# Altium project STM32H7_PCI_CARD.PrjPcb
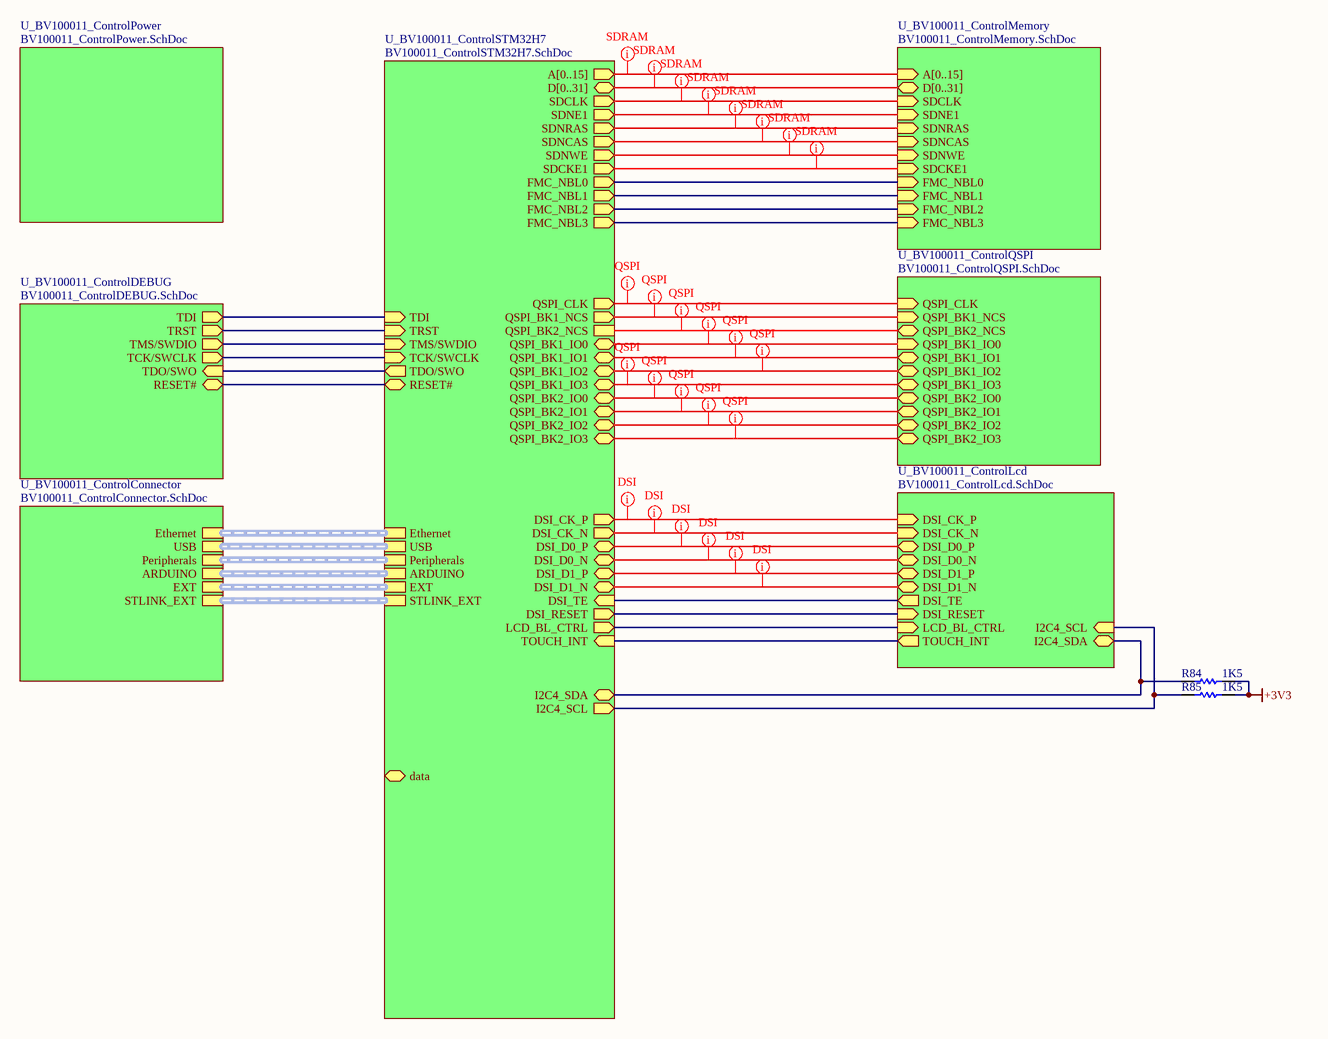
[diagram p0: BV100011_ControlTopLevel.SchDoc]
4 sheets, 175 parts. Net scope: hierarchical (ports join the sheet entries above them; power ports are global).
Board file: STM32H7_PCI_CARD.PcbDoc
Sheets:
  BV100011_ControlTopLevel.SchDoc
    U_BV100011_ControlSTM32H7 = BV100011_ControlSTM32H7.SchDoc
    U_BV100011_ControlPower = BV100011_ControlPower.SchDoc
    U_BV100011_ControlMemory = BV100011_ControlMemory.SchDoc

## Sheet BV100011_ControlTopLevel.SchDoc
size A3

### Parts
R84  1K5  [R0603]
R85  1K5  [R0603]

### Sub-sheets
U_BV100011_ControlConnector = BV100011_ControlConnector.SchDoc (file not in this document): Ethernet (harness Ethernet), USB (harness USB), Peripherals (harness Peripherals), ARDUINO (harness ARDUINO), EXT (harness EXT), STLINK_EXT (harness STLINK_EXT)
U_BV100011_ControlDEBUG = BV100011_ControlDEBUG.SchDoc (file not in this document): TDI (out), RESET# (bidir), TRST (out), TMS/SWDIO (out), TCK/SWCLK (out), TDO/SWO (in)
U_BV100011_ControlLcd = BV100011_ControlLcd.SchDoc (file not in this document): DSI_CK_P (in), DSI_CK_N (in), DSI_D0_P (bidir), DSI_D0_N (bidir), DSI_D1_P (bidir), DSI_D1_N (bidir), LCD_BL_CTRL (in), DSI_TE (out), I2C4_SDA (bidir), I2C4_SCL (in), TOUCH_INT (out), DSI_RESET (in)
U_BV100011_ControlMemory = BV100011_ControlMemory.SchDoc: FMC_NBL0 (in), FMC_NBL1 (in), D[0..31] (bidir), A[0..15] (in), SDNCAS (in), SDNWE (in), SDNRAS (in), SDNE1 (in), SDCKE1 (in), SDCLK (in), FMC_NBL3 (in), FMC_NBL2 (in)
U_BV100011_ControlPower = BV100011_ControlPower.SchDoc: no entries
U_BV100011_ControlQSPI = BV100011_ControlQSPI.SchDoc (file not in this document): QSPI_BK1_IO3 (bidir), QSPI_BK1_IO1 (bidir), QSPI_BK1_NCS (in), QSPI_BK1_IO0 (in), QSPI_BK1_IO2 (bidir), QSPI_CLK (in), QSPI_BK2_IO0 (bidir), QSPI_BK2_IO1 (bidir), QSPI_BK2_IO2 (bidir), QSPI_BK2_IO3 (bidir), QSPI_BK2_NCS (bidir)
U_BV100011_ControlSTM32H7 = BV100011_ControlSTM32H7.SchDoc: TMS/SWDIO (in), TCK/SWCLK (in), TDI (in), TDO/SWO (out), TRST (in), QSPI_CLK (out), QSPI_BK1_IO0 (bidir), FMC_NBL0 (out), FMC_NBL1 (out), SDNRAS (out), QSPI_BK1_IO3 (bidir), QSPI_BK1_IO2 (bidir), QSPI_BK1_IO1 (bidir), SDCLK (out), SDNCAS (out), QSPI_BK1_NCS (out), QSPI_BK2_IO2 (bidir), QSPI_BK2_IO3 (bidir), SDCKE1 (out), SDNE1 (out), SDNWE (out), QSPI_BK2_IO0 (bidir), QSPI_BK2_IO1 (bidir), FMC_NBL3 (out), FMC_NBL2 (out), D[0..31] (bidir), A[0..15] (out), DSI_CK_P (out), DSI_CK_N (out), DSI_D0_P (bidir), DSI_D0_N (bidir), DSI_D1_P (bidir), DSI_D1_N (bidir), LCD_BL_CTRL (out), I2C4_SCL (out), I2C4_SDA (bidir), TOUCH_INT (in), DSI_RESET (out), DSI_TE (in), RESET# (bidir), Ethernet (harness Ethernet), USB (harness USB), Peripherals (harness Peripherals), ARDUINO (harness ARDUINO), EXT (harness EXT), STLINK_EXT (harness STLINK_EXT), QSPI_BK2_NCS, data (bidir)

### Nets
+3V3: R84.1 R85.1
DSI_CK_N: sheet U_BV100011_ControlSTM32H7/DSI_CK_N, sheet U_BV100011_ControlLcd/DSI_CK_N
DSI_CK_P: sheet U_BV100011_ControlSTM32H7/DSI_CK_P, sheet U_BV100011_ControlLcd/DSI_CK_P
DSI_D0_N: sheet U_BV100011_ControlSTM32H7/DSI_D0_N, sheet U_BV100011_ControlLcd/DSI_D0_N
DSI_D0_P: sheet U_BV100011_ControlSTM32H7/DSI_D0_P, sheet U_BV100011_ControlLcd/DSI_D0_P
DSI_D1_N: sheet U_BV100011_ControlSTM32H7/DSI_D1_N, sheet U_BV100011_ControlLcd/DSI_D1_N
DSI_D1_P: sheet U_BV100011_ControlSTM32H7/DSI_D1_P, sheet U_BV100011_ControlLcd/DSI_D1_P
PA13: sheet U_BV100011_ControlSTM32H7/TMS/SWDIO, sheet U_BV100011_ControlDEBUG/TMS/SWDIO
PA14: sheet U_BV100011_ControlSTM32H7/TCK/SWCLK, sheet U_BV100011_ControlDEBUG/TCK/SWCLK
PA15: sheet U_BV100011_ControlSTM32H7/TDI, sheet U_BV100011_ControlDEBUG/TDI
PB2: sheet U_BV100011_ControlSTM32H7/QSPI_CLK, sheet U_BV100011_ControlQSPI/QSPI_CLK
PB3: sheet U_BV100011_ControlSTM32H7/TDO/SWO, sheet U_BV100011_ControlDEBUG/TDO/SWO
PB4: sheet U_BV100011_ControlSTM32H7/TRST, sheet U_BV100011_ControlDEBUG/TRST
PD11: sheet U_BV100011_ControlSTM32H7/QSPI_BK1_IO0, sheet U_BV100011_ControlQSPI/QSPI_BK1_IO0
PD12: R85.2 ; sheet U_BV100011_ControlSTM32H7/I2C4_SCL, sheet U_BV100011_ControlLcd/I2C4_SCL
PD13: R84.2 ; sheet U_BV100011_ControlSTM32H7/I2C4_SDA, sheet U_BV100011_ControlLcd/I2C4_SDA
PE0: sheet U_BV100011_ControlSTM32H7/FMC_NBL0, sheet U_BV100011_ControlMemory/FMC_NBL0
PE1: sheet U_BV100011_ControlSTM32H7/FMC_NBL1, sheet U_BV100011_ControlMemory/FMC_NBL1
PF6: sheet U_BV100011_ControlSTM32H7/QSPI_BK1_IO3, sheet U_BV100011_ControlQSPI/QSPI_BK1_IO3
PF7: sheet U_BV100011_ControlSTM32H7/QSPI_BK1_IO2, sheet U_BV100011_ControlQSPI/QSPI_BK1_IO2
PF9: sheet U_BV100011_ControlSTM32H7/QSPI_BK1_IO1, sheet U_BV100011_ControlQSPI/QSPI_BK1_IO1
PF11: sheet U_BV100011_ControlSTM32H7/SDNRAS, sheet U_BV100011_ControlMemory/SDNRAS
PG3: sheet U_BV100011_ControlSTM32H7/DSI_RESET, sheet U_BV100011_ControlLcd/DSI_RESET
PG6: sheet U_BV100011_ControlSTM32H7/QSPI_BK1_NCS, sheet U_BV100011_ControlQSPI/QSPI_BK1_NCS
PG8: sheet U_BV100011_ControlSTM32H7/SDCLK, sheet U_BV100011_ControlMemory/SDCLK
PG9: sheet U_BV100011_ControlSTM32H7/QSPI_BK2_IO2, sheet U_BV100011_ControlQSPI/QSPI_BK2_IO2
PG14: sheet U_BV100011_ControlSTM32H7/QSPI_BK2_IO3, sheet U_BV100011_ControlQSPI/QSPI_BK2_IO3
PG15: sheet U_BV100011_ControlSTM32H7/SDNCAS, sheet U_BV100011_ControlMemory/SDNCAS
PH2: sheet U_BV100011_ControlSTM32H7/QSPI_BK2_IO0, sheet U_BV100011_ControlQSPI/QSPI_BK2_IO0
PH3: sheet U_BV100011_ControlSTM32H7/QSPI_BK2_IO1, sheet U_BV100011_ControlQSPI/QSPI_BK2_IO1
PH5: sheet U_BV100011_ControlSTM32H7/SDNWE, sheet U_BV100011_ControlMemory/SDNWE
PH6: sheet U_BV100011_ControlSTM32H7/SDNE1, sheet U_BV100011_ControlMemory/SDNE1
PH7: sheet U_BV100011_ControlSTM32H7/SDCKE1, sheet U_BV100011_ControlMemory/SDCKE1
PI4: sheet U_BV100011_ControlSTM32H7/FMC_NBL2, sheet U_BV100011_ControlMemory/FMC_NBL2
PI5: sheet U_BV100011_ControlSTM32H7/FMC_NBL3, sheet U_BV100011_ControlMemory/FMC_NBL3
PJ2: sheet U_BV100011_ControlSTM32H7/DSI_TE, sheet U_BV100011_ControlLcd/DSI_TE
PJ12: sheet U_BV100011_ControlSTM32H7/LCD_BL_CTRL, sheet U_BV100011_ControlLcd/LCD_BL_CTRL
PK7: sheet U_BV100011_ControlSTM32H7/TOUCH_INT, sheet U_BV100011_ControlLcd/TOUCH_INT
RESET#: sheet U_BV100011_ControlSTM32H7/RESET#, sheet U_BV100011_ControlDEBUG/RESET#
NetSB16_1: sheet U_BV100011_ControlSTM32H7/QSPI_BK2_NCS, sheet U_BV100011_ControlQSPI/QSPI_BK2_NCS

### Buses and harness runs
bus sheet U_BV100011_ControlMemory/A[0..15] = sheet U_BV100011_ControlSTM32H7/A[0..15]
bus sheet U_BV100011_ControlMemory/D[0..31] = sheet U_BV100011_ControlSTM32H7/D[0..31]
harness sheet U_BV100011_ControlConnector/ARDUINO = sheet U_BV100011_ControlSTM32H7/ARDUINO
harness sheet U_BV100011_ControlConnector/Ethernet = sheet U_BV100011_ControlSTM32H7/Ethernet
harness sheet U_BV100011_ControlConnector/EXT = sheet U_BV100011_ControlSTM32H7/EXT
harness sheet U_BV100011_ControlConnector/Peripherals = sheet U_BV100011_ControlSTM32H7/Peripherals
harness sheet U_BV100011_ControlConnector/STLINK_EXT = sheet U_BV100011_ControlSTM32H7/STLINK_EXT
harness sheet U_BV100011_ControlConnector/USB = sheet U_BV100011_ControlSTM32H7/USB

### Layout directives
rule Matched Net Lengths [Tolerance = 100mil]; net class SDRAM: (no net found under the mark), PF11, PG8, PG15, PH5, PH6, PH7
rule Matched Net Lengths [Tolerance = 100mil]; net class QSPI: NetSB16_1, PB2, PD11, PF6, PF7, PF9, PG6, PG9, PG14, PH2, PH3
rule Matched Net Lengths [Tolerance = 100mil]; net class DSI: DSI_CK_N, DSI_CK_P, DSI_D0_N, DSI_D0_P, DSI_D1_N, DSI_D1_P

### Library data of the parts
R84 R85 = Res1: Resistor; Value: 1K; Published: 8-Jun-2000; Revision: July-2002: Re-released for DXP Platform.; Publisher: Altium Limited

## Sheet BV100011_ControlSTM32H7.SchDoc
size A3
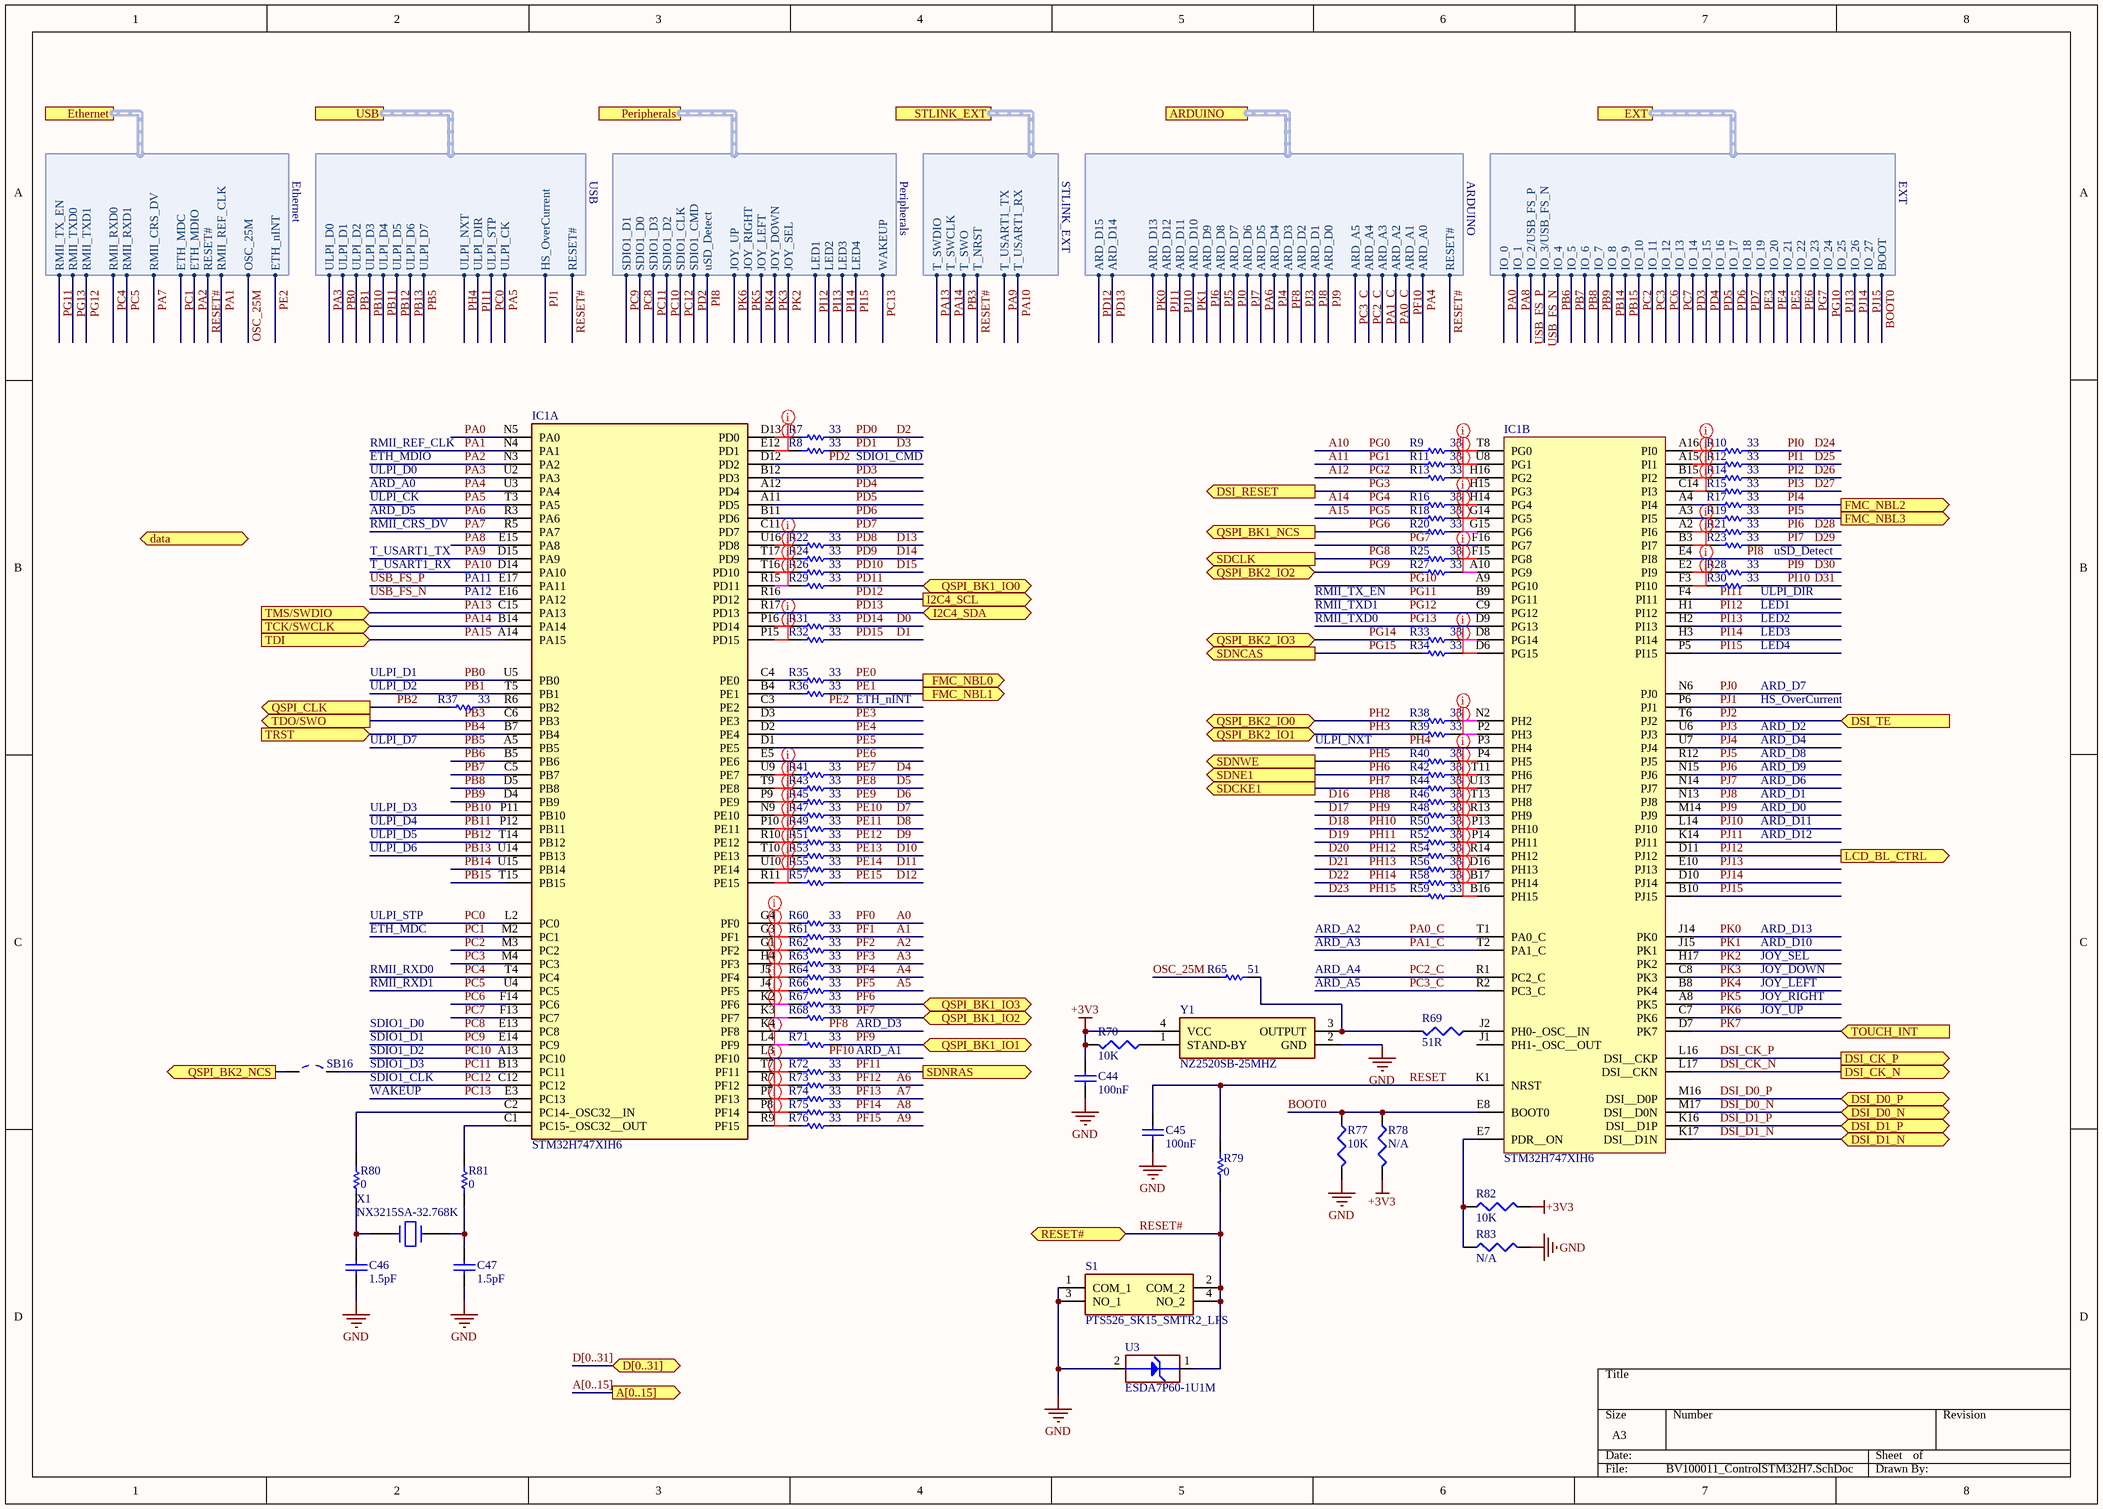
[diagram p1: BV100011_ControlSTM32H7.SchDoc]

### Parts
C44  100nF  [C0402]
C45  100nF  [C0402]
C46  value 1.5pF  [C0402]  (hidden comment: Capacitor)
C47  value 1.5pF  [C0402]  (hidden comment: Capacitor)
IC1  STM32H747XIH6  [BGA265C80P17X17_1400X1400X110]  (parts A,B of 3)
R7  33  [R0402]
R8  33  [R0402]
R9  33  [R0402]
R10  33  [R0402]
R11  33  [R0402]
R12  33  [R0402]
R13  33  [R0402]
R14  33  [R0402]
R15  33  [R0402]
R16  33  [R0402]
R17  33  [R0402]
R18  33  [R0402]
R19  33  [R0402]
R20  33  [R0402]
R21  33  [R0402]
R22  33  [R0402]
R23  33  [R0402]
R24  33  [R0402]
R25  33  [R0402]
R26  33  [R0402]
R27  33  [R0402]
R28  33  [R0402]
R29  33  [R0402]
R30  33  [R0402]
R31  33  [R0402]
R32  33  [R0402]
R33  33  [R0402]
R34  33  [R0402]
R35  33  [R0402]
R36  33  [R0402]
R37  33  [R0402]
R38  33  [R0402]
R39  33  [R0402]
R40  33  [R0402]
R41  33  [R0402]
R42  33  [R0402]
R43  33  [R0402]
R44  33  [R0402]
R45  33  [R0402]
R46  33  [R0402]
R47  33  [R0402]
R48  33  [R0402]
R49  33  [R0402]
R50  33  [R0402]
R51  33  [R0402]
R52  33  [R0402]
R53  33  [R0402]
R54  33  [R0402]
R55  33  [R0402]
R56  33  [R0402]
R57  33  [R0402]
R58  33  [R0402]
R59  33  [R0402]
R60  33  [R0402]
R61  33  [R0402]
R62  33  [R0402]
R63  33  [R0402]
R64  33  [R0402]
R65  51  [R0402]
R66  33  [R0402]
R67  33  [R0402]
R68  33  [R0402]
R69  51R  [R0402]
R70  10K  [R0402]
R71  33  [R0402]
R72  33  [R0402]
R73  33  [R0402]
R74  33  [R0402]
R75  33  [R0402]
R76  33  [R0402]
R77  10K  [R0603]
R78  N/A  [R0603]
R79  0  [R0603]
R80  0  [R0603]
R81  0  [R0603]
R82  10K  [R0603]
R83  N/A  [R0603]
S1  PTS526_SK15_SMTR2_LFS  [PTS526SK15SMTR2LFS]
SB16  Solder Bridge OFF  [SB_0603]  (value not drawn)
U3  value ESDA7P60-1U1M  [ESD_QFN2_1P6X1_P125]  (hidden comment: ESD-TRANSIL)
X1  value NX3215SA-32.768K  [CRY_NX3215SA_2P]  (hidden comment: XTAL_32K_NX3215SA)
Y1  NZ2520SB-25MHZ  [OSC_NDK_NZ2520SB_4P]

### Ports
A[0..15] (out), ARDUINO (harness ARDUINO), D[0..31] (bidir), data (bidir), DSI_CK_N (out), DSI_CK_P (out), DSI_D0_N (bidir), DSI_D0_P (bidir), DSI_D1_N (bidir), DSI_D1_P (bidir), DSI_RESET (out), DSI_TE (in), Ethernet (harness Ethernet), EXT (harness EXT), FMC_NBL0 (out), FMC_NBL1 (out), FMC_NBL2 (out), FMC_NBL3 (out), I2C4_SCL (out), I2C4_SDA (bidir), LCD_BL_CTRL (out), Peripherals (harness Peripherals), QSPI_BK1_IO0 (bidir), QSPI_BK1_IO1 (bidir), QSPI_BK1_IO2 (bidir), QSPI_BK1_IO3 (bidir), QSPI_BK1_NCS (out), QSPI_BK2_IO0 (bidir), QSPI_BK2_IO1 (bidir), QSPI_BK2_IO2 (bidir), QSPI_BK2_IO3 (bidir), QSPI_BK2_NCS (out), QSPI_CLK (out), RESET# (bidir), SDCKE1 (out), SDCLK (out), SDNCAS (out), SDNE1 (out), SDNRAS (out), SDNWE (out), STLINK_EXT (harness STLINK_EXT), TCK/SWCLK (in), TDI (in), TDO/SWO (out), TMS/SWDIO (in), TOUCH_INT (in), TRST (in), USB (harness USB)

### Harnesses
Ethernet: ETH_nINT, ETH_MDC, RMII_REF_CLK, RMII_TXD1, ETH_MDIO, RMII_CRS_DV, RMII_RXD0, RMII_RXD1, RMII_TX_EN, RMII_TXD0, OSC_25M, RESET#
USB: ULPI_D0, ULPI_D1, ULPI_D2, ULPI_D3, ULPI_D4, ULPI_D5, ULPI_D6, ULPI_D7, ULPI_NXT, ULPI_DIR, ULPI_STP, ULPI_CK, RESET#, HS_OverCurrent
Peripherals: SDIO1_D1, SDIO1_D0, SDIO1_D3, SDIO1_D2, SDIO1_CLK, SDIO1_CMD, uSD_Detect, JOY_UP, JOY_RIGHT, JOY_LEFT, JOY_DOWN, JOY_SEL, LED1, LED2, LED3, LED4, WAKEUP
STLINK_EXT: T_SWDIO, T_SWCLK, T_SWO, T_NRST, T_USART1_TX, T_USART1_RX
ARDUINO: RESET#, ARD_A0, ARD_A1, ARD_A2, ARD_A3, ARD_A4, ARD_A5, ARD_D4, ARD_D3, ARD_D2, ARD_D1, ARD_D0, ARD_D9, ARD_D8, ARD_D7, ARD_D6, ARD_D5, ARD_D14, ARD_D13, ARD_D12, ARD_D11, ARD_D10, ARD_D15
EXT: IO_0, IO_1, IO_3/USB_FS_N, IO_4, IO_5, IO_6, IO_7, IO_8, IO_9, IO_10, IO_11, IO_12, IO_13, IO_14, IO_15, IO_16, IO_17, IO_18, IO_19, IO_20, IO_21, IO_22, IO_23, IO_24, IO_25, IO_26, IO_27, BOOT, IO_2/USB_FS_P

### Nets
+3V3: C44.2 R70.2 R78.2 R82.2 Y1.4(VCC)
GND: C44.1 C45.1 C46.1 C47.1 R77.2 R83.2 S1.1(COM_1) S1.3(NO_1) U3.2(GND) Y1.2(GND)
A0: R60.1  [also labelled PF0]
A1: R61.1  [also labelled PF1]
A2: R62.1  [also labelled PF2]
A3: R63.1  [also labelled PF3]
A4: R64.1  [also labelled PF4]
A5: R66.1  [also labelled PF5]
A6: R73.1  [also labelled PF12]
A7: R74.1  [also labelled PF13]
A8: R75.1  [also labelled PF14]
A9: R76.1  [also labelled PF15]
A10: R9.2  [also labelled PG0]
A11: R11.2  [also labelled PG1]
A12: R13.2  [also labelled PG2]
A14: R16.2  [also labelled PG4]
A15: R18.2  [also labelled PG5]
BOOT0: IC1.E8(BOOT0) R77.1 R78.1 ; port EXT.BOOT
D0: R31.1  [also labelled PD14]
D1: R32.1  [also labelled PD15]
D2: R7.1  [also labelled PD0]
D3: R8.1  [also labelled PD1]
D4: R41.1  [also labelled PE7]
D5: R43.1  [also labelled PE8]
D6: R45.1  [also labelled PE9]
D7: R47.1  [also labelled PE10]
D8: R49.1  [also labelled PE11]
D9: R51.1  [also labelled PE12]
D10: R53.1  [also labelled PE13]
D11: R55.1  [also labelled PE14]
D12: R57.1  [also labelled PE15]
D13: R22.1  [also labelled PD8]
D14: R24.1  [also labelled PD9]
D15: R26.1  [also labelled PD10]
D16: R46.2  [also labelled PH8]
D17: R48.2  [also labelled PH9]
D18: R50.2  [also labelled PH10]
D19: R52.2  [also labelled PH11]
D20: R54.2  [also labelled PH12]
D21: R56.2  [also labelled PH13]
D22: R58.2  [also labelled PH14]
D23: R59.2  [also labelled PH15]
D24: R10.1  [also labelled PI0]
D25: R12.1  [also labelled PI1]
D26: R14.1  [also labelled PI2]
D27: R15.1  [also labelled PI3]
D28: R21.1  [also labelled PI6]
D29: R23.1  [also labelled PI7]
D30: R28.1  [also labelled PI9]
D31: R30.1  [also labelled PI10]
DSI_CK_N: IC1.L17(DSI__CKN) ; port DSI_CK_N
DSI_CK_P: IC1.L16(DSI__CKP) ; port DSI_CK_P
DSI_D0_N: IC1.M17(DSI__D0N) ; port DSI_D0_N
DSI_D0_P: IC1.M16(DSI__D0P) ; port DSI_D0_P
DSI_D1_N: IC1.K17(DSI__D1N) ; port DSI_D1_N
DSI_D1_P: IC1.K16(DSI__D1P) ; port DSI_D1_P
OSC_25M: R65.2 ; port Ethernet.OSC_25M
PA0: IC1.N5(PA0) ; port EXT.IO_0
PA0_C: IC1.T1(PA0_C) ; port ARDUINO.ARD_A2
PA1: IC1.N4(PA1) ; port Ethernet.RMII_REF_CLK
PA1_C: IC1.T2(PA1_C) ; port ARDUINO.ARD_A3
PA2: IC1.N3(PA2) ; port Ethernet.ETH_MDIO
PA3: IC1.U2(PA3) ; port USB.ULPI_D0
PA4: IC1.U3(PA4) ; port ARDUINO.ARD_A0
PA5: IC1.T3(PA5) ; port USB.ULPI_CK
PA6: IC1.R3(PA6) ; port ARDUINO.ARD_D5
PA7: IC1.R5(PA7) ; port Ethernet.RMII_CRS_DV
PA8: IC1.E15(PA8) ; port EXT.IO_1
PA9: IC1.D15(PA9) ; port STLINK_EXT.T_USART1_TX
PA10: IC1.D14(PA10) ; port STLINK_EXT.T_USART1_RX
PA13: IC1.C15(PA13) ; port TMS/SWDIO, port STLINK_EXT.T_SWDIO
PA14: IC1.B14(PA14) ; port TCK/SWCLK, port STLINK_EXT.T_SWCLK
PA15: IC1.A14(PA15) ; port TDI
PB0: IC1.U5(PB0) ; port USB.ULPI_D1
PB1: IC1.T5(PB1) ; port USB.ULPI_D2
PB2: R37.2 ; port QSPI_CLK
PB3: IC1.C6(PB3) ; port TDO/SWO, port STLINK_EXT.T_SWO
PB4: IC1.B7(PB4) ; port TRST
PB5: IC1.A5(PB5) ; port USB.ULPI_D7
PB6: IC1.B5(PB6) ; port EXT.IO_4
PB7: IC1.C5(PB7) ; port EXT.IO_5
PB8: IC1.D5(PB8) ; port EXT.IO_6
PB9: IC1.D4(PB9) ; port EXT.IO_7
PB10: IC1.P11(PB10) ; port USB.ULPI_D3
PB11: IC1.P12(PB11) ; port USB.ULPI_D4
PB12: IC1.T14(PB12) ; port USB.ULPI_D5
PB13: IC1.U14(PB13) ; port USB.ULPI_D6
PB14: IC1.U15(PB14) ; port EXT.IO_8
PB15: IC1.T15(PB15) ; port EXT.IO_9
PC0: IC1.L2(PC0) ; port USB.ULPI_STP
PC1: IC1.M2(PC1) ; port Ethernet.ETH_MDC
PC2: IC1.M3(PC2) ; port EXT.IO_10
PC2_C: IC1.R1(PC2_C) ; port ARDUINO.ARD_A4
PC3: IC1.M4(PC3) ; port EXT.IO_11
PC3_C: IC1.R2(PC3_C) ; port ARDUINO.ARD_A5
PC4: IC1.T4(PC4) ; port Ethernet.RMII_RXD0
PC5: IC1.U4(PC5) ; port Ethernet.RMII_RXD1
PC6: IC1.F14(PC6) ; port EXT.IO_12
PC7: IC1.F13(PC7) ; port EXT.IO_13
PC8: IC1.E13(PC8) ; port Peripherals.SDIO1_D0
PC9: IC1.E14(PC9) ; port Peripherals.SDIO1_D1
PC10: IC1.A13(PC10) ; port Peripherals.SDIO1_D2
PC11: IC1.B13(PC11) SB16.2 ; port Peripherals.SDIO1_D3
PC12: IC1.C12(PC12) ; port Peripherals.SDIO1_CLK
PC13: IC1.E3(PC13) ; port Peripherals.WAKEUP
PD2: IC1.D12(PD2) ; port Peripherals.SDIO1_CMD
PD3: IC1.B12(PD3) ; port EXT.IO_14
PD4: IC1.A12(PD4) ; port EXT.IO_15
PD5: IC1.A11(PD5) ; port EXT.IO_16
PD6: IC1.B11(PD6) ; port EXT.IO_17
PD7: IC1.C11(PD7) ; port EXT.IO_18
PD11: R29.1 ; port QSPI_BK1_IO0
PD12: IC1.R16(PD12) ; port I2C4_SCL, port ARDUINO.ARD_D15
PD13: IC1.R17(PD13) ; port I2C4_SDA, port ARDUINO.ARD_D14
PE0: R35.1 ; port FMC_NBL0
PE1: R36.1 ; port FMC_NBL1
PE2: IC1.C3(PE2) ; port Ethernet.ETH_nINT
PE3: IC1.D3(PE3) ; port EXT.IO_19
PE4: IC1.D2(PE4) ; port EXT.IO_20
PE5: IC1.D1(PE5) ; port EXT.IO_21
PE6: IC1.E5(PE6) ; port EXT.IO_22
PF6: R67.1 ; port QSPI_BK1_IO3
PF7: R68.1 ; port QSPI_BK1_IO2
PF8: IC1.K4(PF8) ; port ARDUINO.ARD_D3
PF9: R71.1 ; port QSPI_BK1_IO1
PF10: IC1.L3(PF10) ; port ARDUINO.ARD_A1
PF11: R72.1 ; port SDNRAS
PG3: IC1.H15(PG3) ; port DSI_RESET
PG6: R20.2 ; port QSPI_BK1_NCS
PG7: IC1.F16(PG7) ; port EXT.IO_23
PG8: R25.2 ; port SDCLK
PG9: R27.2 ; port QSPI_BK2_IO2
PG10: IC1.A9(PG10) ; port EXT.IO_24
PG11: IC1.B9(PG11) ; port Ethernet.RMII_TX_EN
PG12: IC1.C9(PG12) ; port Ethernet.RMII_TXD1
PG13: IC1.D9(PG13) ; port Ethernet.RMII_TXD0
PG14: R33.2 ; port QSPI_BK2_IO3
PG15: R34.2 ; port SDNCAS
PH2: R38.2 ; port QSPI_BK2_IO0
PH3: R39.2 ; port QSPI_BK2_IO1
PH4: IC1.P3(PH4) ; port USB.ULPI_NXT
PH5: R40.2 ; port SDNWE
PH6: R42.2 ; port SDNE1
PH7: R44.2 ; port SDCKE1
PI4: R17.1 ; port FMC_NBL2
PI5: R19.1 ; port FMC_NBL3
PI8: IC1.E4(PI8) ; port Peripherals.uSD_Detect
PI11: IC1.F4(PI11) ; port USB.ULPI_DIR
PI12: IC1.H1(PI12) ; port Peripherals.LED1
PI13: IC1.H2(PI13) ; port Peripherals.LED2
PI14: IC1.H3(PI14) ; port Peripherals.LED3
PI15: IC1.P5(PI15) ; port Peripherals.LED4
PJ0: IC1.N6(PJ0) ; port ARDUINO.ARD_D7
PJ1: IC1.P6(PJ1) ; port USB.HS_OverCurrent
PJ2: IC1.T6(PJ2) ; port DSI_TE
PJ3: IC1.U6(PJ3) ; port ARDUINO.ARD_D2
PJ4: IC1.U7(PJ4) ; port ARDUINO.ARD_D4
PJ5: IC1.R12(PJ5) ; port ARDUINO.ARD_D8
PJ6: IC1.N15(PJ6) ; port ARDUINO.ARD_D9
PJ7: IC1.N14(PJ7) ; port ARDUINO.ARD_D6
PJ8: IC1.N13(PJ8) ; port ARDUINO.ARD_D1
PJ9: IC1.M14(PJ9) ; port ARDUINO.ARD_D0
PJ10: IC1.L14(PJ10) ; port ARDUINO.ARD_D11
PJ11: IC1.K14(PJ11) ; port ARDUINO.ARD_D12
PJ12: IC1.D11(PJ12) ; port LCD_BL_CTRL
PJ13: IC1.E10(PJ13) ; port EXT.IO_25
PJ14: IC1.D10(PJ14) ; port EXT.IO_26
PJ15: IC1.B10(PJ15) ; port EXT.IO_27
PK0: IC1.J14(PK0) ; port ARDUINO.ARD_D13
PK1: IC1.J15(PK1) ; port ARDUINO.ARD_D10
PK2: IC1.H17(PK2) ; port Peripherals.JOY_SEL
PK3: IC1.C8(PK3) ; port Peripherals.JOY_DOWN
PK4: IC1.B8(PK4) ; port Peripherals.JOY_LEFT
PK5: IC1.A8(PK5) ; port Peripherals.JOY_RIGHT
PK6: IC1.C7(PK6) ; port Peripherals.JOY_UP
PK7: IC1.D7(PK7) ; port TOUCH_INT
RESET: C45.2 IC1.K1(NRST) R79.1
RESET#: R79.2 S1.2(COM_2) S1.4(NO_2) U3.1(IO1) ; port RESET#, port Ethernet.RESET#, port USB.RESET#, port STLINK_EXT.T_NRST, port ARDUINO.RESET#
USB_FS_N: IC1.E16(PA12) ; port EXT.IO_3/USB_FS_N
USB_FS_P: IC1.E17(PA11) ; port EXT.IO_2/USB_FS_P
NetC46_2: C46.2 R80.2 X1.1
NetC47_2: C47.2 R81.2 X1.2
NetIC1_A2: IC1.A2(PI6) R21.2
NetIC1_A3: IC1.A3(PI5) R19.2
NetIC1_A4: IC1.A4(PI4) R17.2
NetIC1_A10: IC1.A10(PG9) R27.1
NetIC1_A15: IC1.A15(PI1) R12.2
NetIC1_A16: IC1.A16(PI0) R10.2
NetIC1_B3: IC1.B3(PI7) R23.2
NetIC1_B4: IC1.B4(PE1) R36.2
NetIC1_B15: IC1.B15(PI2) R14.2
NetIC1_B16: IC1.B16(PH15) R59.1
NetIC1_B17: IC1.B17(PH14) R58.1
NetIC1_C1: IC1.C1(PC15-_OSC32__OUT) R81.1
NetIC1_C2: IC1.C2(PC14-_OSC32__IN) R80.1
NetIC1_C4: IC1.C4(PE0) R35.2
NetIC1_C14: IC1.C14(PI3) R15.2
NetIC1_D6: IC1.D6(PG15) R34.1
NetIC1_D8: IC1.D8(PG14) R33.1
NetIC1_D13: IC1.D13(PD0) R7.2
NetIC1_D16: IC1.D16(PH13) R56.1
NetIC1_E2: IC1.E2(PI9) R28.2
NetIC1_E7: IC1.E7(PDR__ON) R82.1 R83.1
NetIC1_E12: IC1.E12(PD1) R8.2
NetIC1_F3: IC1.F3(PI10) R30.2
NetIC1_F15: IC1.F15(PG8) R25.1
NetIC1_G1: IC1.G1(PF2) R62.2
NetIC1_G3: IC1.G3(PF1) R61.2
NetIC1_G4: IC1.G4(PF0) R60.2
NetIC1_G14: IC1.G14(PG5) R18.1
NetIC1_G15: IC1.G15(PG6) R20.1
NetIC1_H4: IC1.H4(PF3) R63.2
NetIC1_H14: IC1.H14(PG4) R16.1
NetIC1_H16: IC1.H16(PG2) R13.1
NetIC1_J2: IC1.J2(PH0-_OSC__IN) R69.1
NetIC1_J4: IC1.J4(PF5) R66.2
NetIC1_J5: IC1.J5(PF4) R64.2
NetIC1_K2: IC1.K2(PF6) R67.2
NetIC1_K3: IC1.K3(PF7) R68.2
NetIC1_L4: IC1.L4(PF9) R71.2
NetIC1_N2: IC1.N2(PH2) R38.1
NetIC1_N9: IC1.N9(PE10) R47.2
NetIC1_P2: IC1.P2(PH3) R39.1
NetIC1_P4: IC1.P4(PH5) R40.1
NetIC1_P7: IC1.P7(PF13) R74.2
NetIC1_P8: IC1.P8(PF14) R75.2
NetIC1_P9: IC1.P9(PE9) R45.2
NetIC1_P10: IC1.P10(PE11) R49.2
NetIC1_P13: IC1.P13(PH10) R50.1
NetIC1_P14: IC1.P14(PH11) R52.1
NetIC1_P15: IC1.P15(PD15) R32.2
NetIC1_P16: IC1.P16(PD14) R31.2
NetIC1_R6: IC1.R6(PB2) R37.1
NetIC1_R7: IC1.R7(PF12) R73.2
NetIC1_R9: IC1.R9(PF15) R76.2
NetIC1_R10: IC1.R10(PE12) R51.2
NetIC1_R11: IC1.R11(PE15) R57.2
NetIC1_R13: IC1.R13(PH9) R48.1
NetIC1_R14: IC1.R14(PH12) R54.1
NetIC1_R15: IC1.R15(PD11) R29.2
NetIC1_T7: IC1.T7(PF11) R72.2
NetIC1_T8: IC1.T8(PG0) R9.1
NetIC1_T9: IC1.T9(PE8) R43.2
NetIC1_T10: IC1.T10(PE13) R53.2
NetIC1_T11: IC1.T11(PH6) R42.1
NetIC1_T13: IC1.T13(PH8) R46.1
NetIC1_T16: IC1.T16(PD10) R26.2
NetIC1_T17: IC1.T17(PD9) R24.2
NetIC1_U8: IC1.U8(PG1) R11.1
NetIC1_U9: IC1.U9(PE7) R41.2
NetIC1_U10: IC1.U10(PE14) R55.2
NetIC1_U13: IC1.U13(PH7) R44.1
NetIC1_U16: IC1.U16(PD8) R22.2
NetR65_1: R65.1 R69.2 Y1.3(OUTPUT)
NetR70_1: R70.1 Y1.1(STAND-BY)
NetSB16_1: SB16.1 ; port QSPI_BK2_NCS

Not connected (* = marked no-connect by the designer): IC1 J1(PH1-_OSC__OUT)

### Buses and harness runs
bus A[0..15] = port A[0..15]
bus D[0..31] = port D[0..31]

### Layout directives
net class SDRAM_MCU; rule Matched Net Lengths [Tolerance = 100mil]: NetIC1_A2, NetIC1_A15, NetIC1_A16, NetIC1_B3, NetIC1_B15, NetIC1_B16, NetIC1_B17, NetIC1_C14, NetIC1_D6, NetIC1_D13, NetIC1_D16, NetIC1_E2, NetIC1_E12, NetIC1_F3, NetIC1_F15, NetIC1_G1, NetIC1_G3, NetIC1_G4, NetIC1_G14, NetIC1_H4, NetIC1_H14, NetIC1_H16, NetIC1_J4, NetIC1_J5, NetIC1_N9, NetIC1_P4, NetIC1_P7, NetIC1_P8, NetIC1_P9, NetIC1_P10, NetIC1_P13, NetIC1_P14, NetIC1_P15, NetIC1_P16, NetIC1_R7, NetIC1_R9, NetIC1_R10, NetIC1_R11, NetIC1_R13, NetIC1_R14, NetIC1_T7, NetIC1_T8, NetIC1_T9, NetIC1_T10, NetIC1_T11, NetIC1_T13, NetIC1_T16, NetIC1_T17, NetIC1_U8, NetIC1_U9, NetIC1_U10, NetIC1_U13, NetIC1_U16
rule Matched Net Lengths [Tolerance = 100mil]; net class QSPI_MCU: NetIC1_A10, NetIC1_D8, NetIC1_G15, NetIC1_K2, NetIC1_K3, NetIC1_L4, NetIC1_N2, NetIC1_P2, NetIC1_R15

### Notes on the sheet
- RMII_REF_CLK
- ETH_MDIO
- ULPI_D0
- ULPI_CK
- ARD_A0
- ARD_D5
- SDIO1_CMD
- RMII_CRS_DV
- T_USART1_TX
- T_USART1_RX
- (near IC1) PA11
- uSD_Detect
- (near IC1) PA12
- RMII_TX_EN
- RMII_TXD1
- RMII_TXD0
- ULPI_DIR
- LED1
- LED2
- LED3
- LED4
- (near R37) ULPI_D1
- (near R37) ULPI_D2
- ETH_nINT
- HS_OverCurrent
- ARD_D7
- (near R37) ULPI_D7
- ULPI_NXT
- ARD_D2
- ARD_D4
- ARD_D6
- ARD_D8
- ARD_D9
- ULPI_D3
- ULPI_D4
- ULPI_D5
- ULPI_D6
- ARD_D0
- ARD_D1
- ARD_D11
- ARD_D12
- ULPI_STP
- ETH_MDC
- RMII_RXD0
- RMII_RXD1
- ARD_A2
- ARD_A3
- ARD_A4
- (near Y1) ARD_A5
- JOY_SEL
- JOY_DOWN
- JOY_LEFT
- ARD_D10
- ARD_D13
- SDIO1_D0
- (near SB16) SDIO1_D1
- (near SB16) SDIO1_D2
- ARD_A1
- ARD_D3
- JOY_RIGHT
- JOY_UP
- WAKEUP
- (near SB16) SDIO1_D3
- (near SB16) SDIO1_CLK

### Library data of the parts
C44 C45 = Cap Semi: Capacitor (Semiconductor SIM Model); Published: 8-Jun-2000; LatestRevisionDate: 29-May-2009; LatestRevisionNote: IPC-7351 Footprint Added.; PackageReference: C1206; Publisher: Altium Limited; PackageDescription: Chip Capacitor; Value: 100nF
C46 C47 = MCD-00563: Capacitor, MLCC, 1.5pF, 50V, NPO, +-0.25pF, 0402, T=0,5mm; Manufacturer_Part_Number: CC0402CRNPO9BN1R5; Manufacturer: YAGEO; Provided_By: Subcon; Initial_Board_Reference: MB1331; Internal_Part_Number: MCD-00563; Status: Released; Part_Type: Capacitor; Package: C0402; ComponentLink1Description: Yageo_Capacitor_NP0_16V-to-50V.pdf; ComponentLink1URL: http://tunmcdsvn.tun.st.com/Component_Datasheet_Library/Trunk/Capacitors/Yageo_Capacitor_NP0_16V-to-50V; ECCN_US: n/a; ECCN_EU: n/a
IC1 = STM32H747XIH6: Integrated Circuit; Manufacturer_Name: STMicroelectronics; Datasheet Link: https://www.st.com/en/microcontrollers-microprocessors/stm32h747xi.html; Height: 1.1mm; Manufacturer_Part_Number: STM32H747XIH6; Mouser Part Number: 511-STM32H747XIH6; Mouser Price/Stock: https://www.mouser.com/Search/Refine.aspx?Keyword=511-STM32H747XIH6
R7-R68 R71-R76 R80 R81 = Res1: Resistor; Value: 1K; Published: 8-Jun-2000; Revision: July-2002: Re-released for DXP Platform.; Publisher: Altium Limited
R69 R70 R77 R78 R82 R83 = Res3: Resistor; Published: 8-Jun-2000; LatestRevisionDate: 29-May-2009; LatestRevisionNote: IPC-7351 Footprint Added.; PackageReference: J1-0603; Publisher: Altium Limited; PackageDescription: Chip Resistor
  R69: Value: 51R
  R70 R77 R82: Value: 10K
  R78 R83: Value: N/A
R79 = res1: Resistor; Value: 1K; Published: 8-Jun-2000; Revision: July-2002: Re-released for DXP Platform.; Publisher: Altium Limited
S1 = PTS526_SK15_SMTR2_LFS: Switch; Manufacturer_Name: C & K COMPONENTS; Manufacturer_Part_Number: PTS526 SK15 SMTR2 LFS; Datasheet Link: https://www.ckswitches.com/media/2780/pts526.pdf; Height: 1.65mm; Mouser Part Number: 611-PTS526SK15SMR2L; Mouser Price/Stock: https://www.mouser.com/Search/Refine.aspx?Keyword=611-PTS526SK15SMR2L
SB16 = SB_OFF: Fitted: NO; Ordered by: Subcon; Revision: July-2002: Re-released for DXP Platform.; ECCN_US/EU: n/a
U3 = MCD-00251: High power transient voltage suppressor, 7V breakdown; Part_Type: IC; Manufacturer: STMICROELECTRONICS; ECCN_US: EAR99; ECCN_EU: NEC; Provided_By: Subcon; Initial_Board_Reference: MB1311; Internal_Part_Number: MCD-00251; Status: Released; Manufacturer_Part_Number: ESDA7P60-1U1M; ComponentLink1Description: STM_ESD_ESDA7P60-1U1M.pdf; ComponentLink1URL: http://tunmcdsvn.tun.st.com/Component_Datasheet_Library/Trunk/Diodes/STM_ESD_ESDA7P60-1U1M
X1 = MCD-00091: Crystal 32.768kHz, 6pF, -+20PPM, R=50K, SMD; Part_Type: Crystal_Osc; Manufacturer_Part_Number: NX3215SA 32.768KHz EXS00A-MU00525; Manufacturer: NDK; ECCN_US: EAR99; ECCN_EU: NEC; Provided_By: STM; Initial_Board_Reference: mb1274; Internal_Part_Number: MCD-00091; Status: Released; ComponentLink1Description: NDK_Crystal-For-ST_NX3215SA 32.768KHz EXS00A-MU00525 (EXS10B-21238).pdf; ComponentLink1URL: http://tunmcdsvn.tun.st.com/Component_Datasheet_Library/Trunk/Crystal_Osc/NDK_Crystal-For-ST_NX3215SA 32.768KHz EXS00A-MU00525 (EXS10B-21238).pdf
Y1 = NZ2520SB-25.600MHZ: Crystal or Oscillator; Manufacturer_Name: NDK; Datasheet Link: https://media.digikey.com/PDF/Data%20Sheets/NDK%20PDFs/NZ2520SB.pdf; Height: 0.9mm; Manufacturer_Part_Number: NZ2520SB-25.600MHZ; Mouser Part Number: N/A; Mouser Price/Stock: https://www.mouser.com/Search/Refine.aspx?Keyword=N%2FA

## Sheet BV100011_ControlPower.SchDoc
size A4
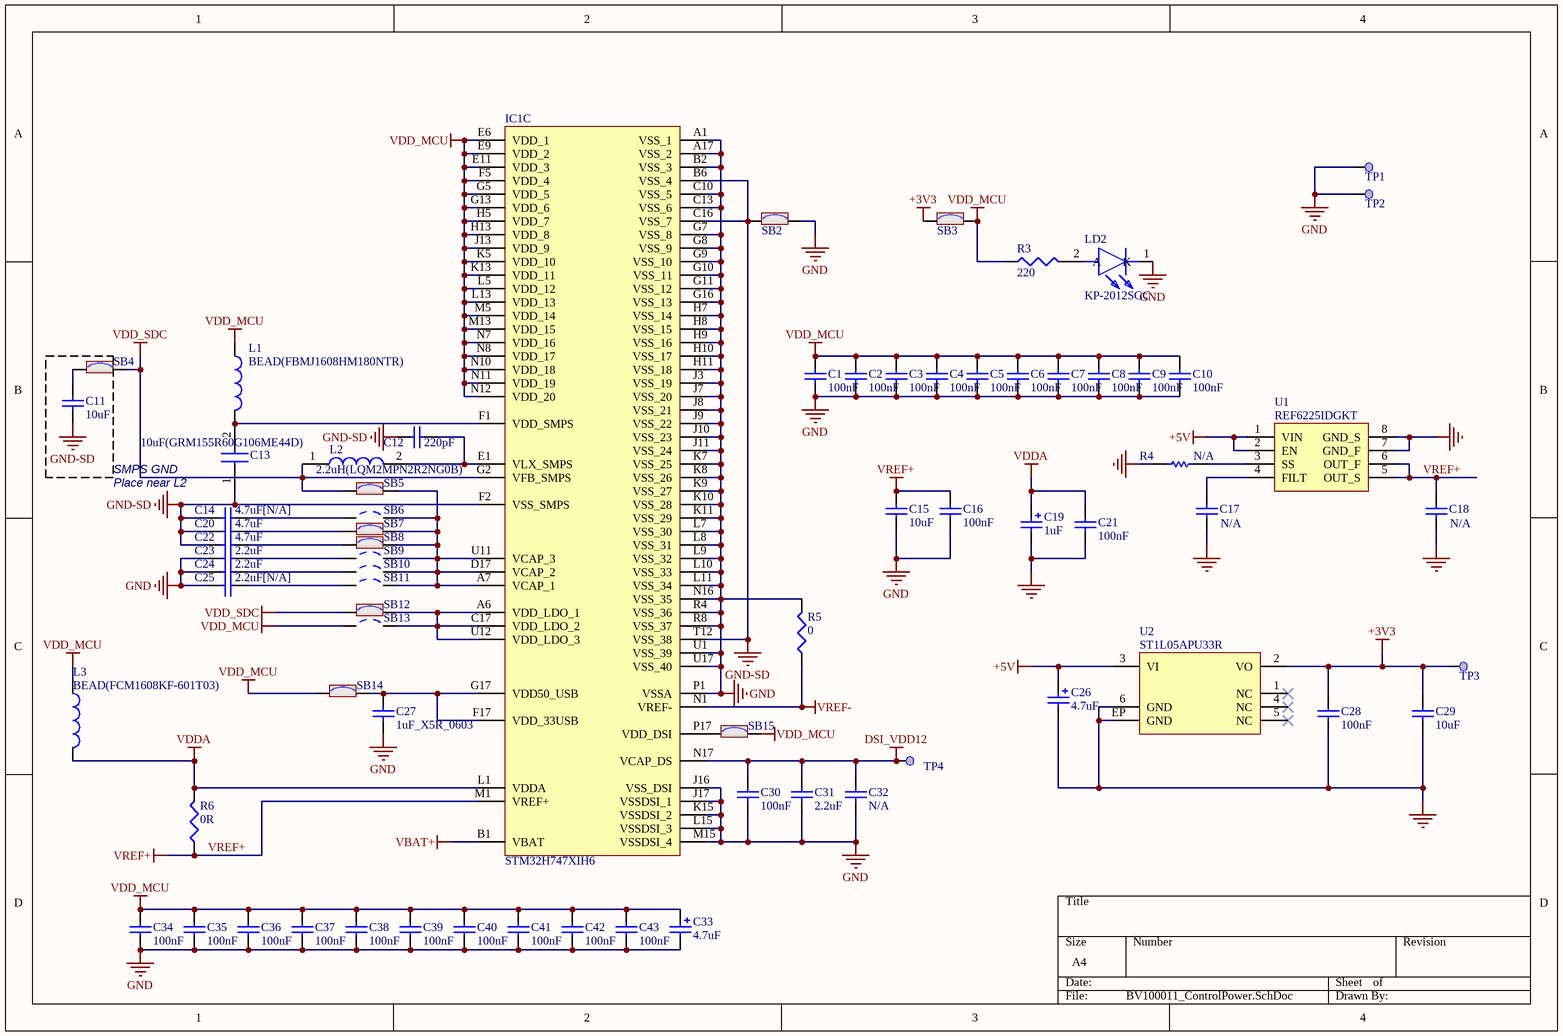
[diagram p2: BV100011_ControlPower.SchDoc]

### Parts
C1  100nF  [C0402]
C2  100nF  [C0402]
C3  100nF  [C0402]
C4  100nF  [C0402]
C5  100nF  [C0402]
C6  100nF  [C0402]
C7  100nF  [C0402]
C8  100nF  [C0402]
C9  100nF  [C0402]
C10  100nF  [C0402]
C11  10uF  [C0603]
C12  220pF  [C0402]
C13  10uF(GRM155R60G106ME44D)  [C0402]
C14  4.7uF[N/A]  [C0402]
C15  value 10uF  [C0805]  (hidden comment: Capacitor)
C16  100nF  [C0402]
C17  N/A  [C0603]
C18  N/A  [C1210]
C19  value 1uF  [CPOL_VISHAY_TANTAL-595D_1407_H220]  (hidden comment: Cap_POL_TANA)
C20  4.7uF  [C0402]
C21  value 100nF  [C0402]  (hidden comment: Capacitor)
C22  4.7uF  [C0402]
C23  2.2uF  [C0603]
C24  2.2uF  [C0603]
C25  2.2uF[N/A]  [C0603]
C26  value 4.7uF  [CPOL_VISHAY_TANTAL-595D_1407_H220]  (hidden comment: Cap_POL_TANA)
C27  1uF_X5R_0603  [C0603]
C28  value 100nF  [C0402]  (hidden comment: Capacitor)
C29  value 10uF  [C0805]  (hidden comment: Capacitor)
C30  100nF  [C0402]
C31  2.2uF  [C0603]
C32  N/A  [C1206]
C33  value 4.7uF  [CPOL_VISHAY_TANTAL-595D_1407_H220]  (hidden comment: Cap_POL_TANA)
C34  100nF  [C0402]
C35  100nF  [C0402]
C36  100nF  [C0402]
C37  100nF  [C0402]
C38  100nF  [C0402]
C39  100nF  [C0402]
C40  100nF  [C0402]
C41  100nF  [C0402]
C42  100nF  [C0402]
C43  100nF  [C0402]
IC1  STM32H747XIH6  [BGA265C80P17X17_1400X1400X110]  (part C of 3)
L1  BEAD(FBMJ1608HM180NTR)  [L0603]
L2  2.2uH(LQM2MPN2R2NG0B)  [IND_2016_MURATA_LQM2MPN2R2NG0]
L3  BEAD(FCM1608KF-601T03)  [L0603]
LD2  KP-2012SGC  [LEDC2012X110N]
R3  220  [R0603]
R4  N/A  [R0402]
R5  0  [R0603]
R6  0R  [R0603]
SB2  SB_ON  [SB_0603]  (value not drawn)
SB3  SB_ON  [SB_0603]  (value not drawn)
SB4  Solder Bridge ON  [SB_0603]  (value not drawn)
SB5  Solder Bridge ON  [SB_0603]  (value not drawn)
SB6  Solder Bridge OFF  [SB_0603]  (value not drawn)
SB7  Solder Bridge ON  [SB_0603]  (value not drawn)
SB8  Solder Bridge ON  [SB_0603]  (value not drawn)
SB9  Solder Bridge OFF  [SB_0603]  (value not drawn)
SB10  Solder Bridge OFF  [SB_0603]  (value not drawn)
SB11  Solder Bridge OFF  [SB_0603]  (value not drawn)
SB12  Solder Bridge ON  [SB_0603]  (value not drawn)
SB13  Solder Bridge OFF  [SB_0603]  (value not drawn)
SB14  Solder Bridge ON  [SB_0603]  (value not drawn)
SB15  Solder Bridge ON  [SB_0603]  (value not drawn)
TP1  Test Point  [TP_SMD_0-3MM]  (value not drawn)  (no BOM)
TP2  Test Point  [TP_SMD_0-3MM]  (value not drawn)  (no BOM)
TP3  Test Point  [TP_SMD_0-3MM]  (value not drawn)  (no BOM)
TP4  Test Point  [TP_SMD_0-3MM]  (value not drawn)  (no BOM)
U1  value REF6225IDGKT  [ICC_VSSOP8_DGK_S-PDSO-G8_3X3_P065]
U2  ST1L05APU33R  [ICC_DFN6-EPAD_3X3_P095]

### Nets
+3V3: C28.1 C29.2 SB3.1 TP3.1 U2.2(VO)
+5V: C26.1 U1.1(VIN) U1.2(EN) U2.3(VI)
DSI_VDD12: C30.2 C31.2 C32.2 IC1.N17(VCAP_DS) TP4.1
GND: C1.1 C2.1 C3.1 C4.1 C5.1 C6.1 C7.1 C8.1 C9.1 C10.1 C15.1 C16.1 C17.1 C18.1 C19.2 C21.1 C23.1 C24.1 C25.1 C26.2 C27.1 C28.2 C29.1 C30.1 C31.1 C32.1 C33.2 C34.1 C35.1 C36.1 C37.1 C38.1 C39.1 C40.1 C41.1 C42.1 C43.1 IC1.A1(VSS_1) IC1.A17(VSS_2) IC1.B2(VSS_3) IC1.C10(VSS_5) IC1.C13(VSS_6) IC1.G7(VSS_8) IC1.G8(VSS_9) IC1.G9(VSS_10) IC1.G10(VSS_11) IC1.G11(VSS_12) IC1.G16(VSS_13) IC1.H7(VSS_14) IC1.H8(VSS_15) IC1.H9(VSS_16) IC1.H10(VSS_17) IC1.H11(VSS_18) IC1.J3(VSS_19) IC1.J7(VSS_20) IC1.J8(VSS_21) IC1.J9(VSS_22) IC1.J10(VSS_23) IC1.J11(VSS_24) IC1.J16(VSS_DSI) IC1.J17(VSSDSI_1) IC1.K7(VSS_25) IC1.K8(VSS_26) IC1.K9(VSS_27) IC1.K10(VSS_28) IC1.K11(VSS_29) IC1.K15(VSSDSI_2) IC1.L7(VSS_30) IC1.L8(VSS_31) IC1.L9(VSS_32) IC1.L10(VSS_33) IC1.L11(VSS_34) IC1.L15(VSSDSI_3) IC1.M15(VSSDSI_4) IC1.N16(VSS_35) IC1.P1(VSSA) IC1.R4(VSS_36) IC1.R8(VSS_37) IC1.U1(VSS_39) IC1.U17(VSS_40) LD2.1(K) R4.1 R5.2 SB2.2 TP1.1 TP2.1 U1.7(GND_F) U1.8(GND_S) U2.6(GND) U2.EP(GND)
GND-SD: C11.1 C12.1 C13.1 C14.1 C20.1 C22.1 IC1.B6(VSS_4) IC1.C16(VSS_7) IC1.F2(VSS_SMPS) IC1.T12(VSS_38) SB2.1
VBAT+: IC1.B1(VBAT)
VDD_MCU: C1.2 C2.2 C3.2 C4.2 C5.2 C6.2 C7.2 C8.2 C9.2 C10.2 C33.1 C34.2 C35.2 C36.2 C37.2 C38.2 C39.2 C40.2 C41.2 C42.2 C43.2 IC1.E6(VDD_1) IC1.E9(VDD_2) IC1.E11(VDD_3) IC1.F5(VDD_4) IC1.G5(VDD_5) IC1.G13(VDD_6) IC1.H5(VDD_7) IC1.H13(VDD_8) IC1.J13(VDD_9) IC1.K5(VDD_10) IC1.K13(VDD_11) IC1.L5(VDD_12) IC1.L13(VDD_13) IC1.M5(VDD_14) IC1.M13(VDD_15) IC1.N7(VDD_16) IC1.N8(VDD_17) IC1.N10(VDD_18) IC1.N11(VDD_19) IC1.N12(VDD_20) L1.1 L3.1 R3.1 SB3.2 SB13.1 SB14.1 SB15.2
VDD_SDC: IC1.G2(VFB_SMPS) L2.1 SB4.2 SB5.1 SB12.1
VDDA: C19.1 C21.2 IC1.L1(VDDA) L3.2 R6.2
VREF+: C15.2 C16.2 C18.2 IC1.M1(VREF+) R6.1 U1.5(OUT_S) U1.6(OUT_F)
VREF-: IC1.N1(VREF-) R5.1
NetC11_2: C11.2 SB4.1
NetC12_2: C12.2 IC1.E1(VLX_SMPS) L2.2
NetC13_2: C13.2 IC1.F1(VDD_SMPS) L1.2
NetC14_2: C14.2 SB6.1
NetC17_2: C17.2 U1.4(FILT)
NetC20_2: C20.2 SB7.1
NetC22_2: C22.2 SB8.1
NetC23_2: C23.2 SB9.1
NetC24_2: C24.2 SB10.1
NetC25_2: C25.2 SB11.1
NetC27_2: C27.2 IC1.F17(VDD_33USB) IC1.G17(VDD50_USB) SB14.2
NetIC1_A6: IC1.A6(VDD_LDO_1) IC1.C17(VDD_LDO_2) IC1.U12(VDD_LDO_3) SB12.2 SB13.2
NetIC1_A7: IC1.A7(VCAP_1) IC1.D17(VCAP_2) IC1.U11(VCAP_3) SB5.2 SB6.2 SB7.2 SB8.2 SB9.2 SB10.2 SB11.2
NetIC1_P17: IC1.P17(VDD_DSI) SB15.1
NetLD2_2: LD2.2(A) R3.2
NetR4_2: R4.2 U1.3(SS)

Not connected (* = marked no-connect by the designer): U2 1(NC)* 4(NC)* 5(NC)*

### Notes on the sheet
- SMPS GND
- Place near L2

### Library data of the parts
C1-C12 C16 C20 C22 C30-C32 C34-C43 = Cap Semi: Capacitor (Semiconductor SIM Model); Published: 8-Jun-2000; LatestRevisionDate: 29-May-2009; LatestRevisionNote: IPC-7351 Footprint Added.; PackageReference: C1206; Publisher: Altium Limited; PackageDescription: Chip Capacitor
  C1-C10 C16 C30 C34-C43: Value: 100nF
  C11: Value: 10uF
  C12: Value: 220pF
  C20 C22: Value: 4.7uF
  C31: Value: 2.2uF
  C32: Value: N/A
C13 = GRM155R60G106ME44D: Capacitor; Manufacturer_Name: Murata Electronics; Datasheet Link: http://www.murata.com/~/media/webrenewal/support/library/catalog/products/capacitor/mlcc/c02e.pdf; Height: 0.55mm; Manufacturer_Part_Number: GRM155R60G106ME44D; Mouser Part Number: 81-GRM155R60G106ME4D; Mouser Price/Stock: https://www.mouser.com/Search/Refine.aspx?Keyword=81-GRM155R60G106ME4D; RS Part Number: 1726711P; RS Price/Stock: http://uk.rs-online.com/web/p/products/1726711P
C14 = Cap Semi: Capacitor (Semiconductor SIM Model); Value: 4.7uF; Published: 8-Jun-2000; LatestRevisionDate: 29-May-2009; LatestRevisionNote: IPC-7351 Footprint Added.; PackageReference: C1206; Publisher: Altium Limited; PackageDescription: Chip Capacitor
C15 C29 = MCD-00014: Capacitor, MLCC, 10uF, 25V, X5R, 10%, 0805, T=0,85mm; Manufacturer_Part_Number: CC0805KRX5R8BB106; Manufacturer: YAGEO; Provided_By: Subcon; Initial_Board_Reference: mb1274; Internal_Part_Number: MCD-00014; ECCN_US: n/a; ECCN_EU: n/a; ComponentLink1Description: Yageo_Capacitor_X5R-series.pdf; Status: Released; Part_Type: Capacitor; Package: C0805; ComponentLink1URL: http://tunmcdsvn.tun.st.com/Component_Datasheet_Library/Trunk/Capacitors/Yageo_Capacitor_X5R-series.pdf
C17 = MCD-00010: Capacitor, MLCC, 1uF, 16V, X5R, 10%, 0603, T=0,8mm; Manufacturer_Part_Number: CC0603KRX5R7BB105; Manufacturer: YAGEO; Provided_By: Subcon; Initial_Board_Reference: mb1274; Internal_Part_Number: MCD-00010; Value: 1uF; Status: Released; Part_Type: Capacitor; Package: C0603; ComponentLink1Description: Yageo_Capacitor_X5R-series.pdf; ComponentLink1URL: http://tunmcdsvn.tun.st.com/Component_Datasheet_Library/Trunk/Capacitors/Yageo_Capacitor_X5R-series.pdf; ECCN_US: n/a; ECCN_EU: n/a
C18 = MCD-00614: Capacitor, MLCC, 22uF, 16V, 1210, X7R, 20%, T=2,5mm, ESR 2mohm@410KHz; Manufacturer_Part_Number: GCM32ER71C226ME19; Manufacturer: MURATA; Provided_By: Subcon; Initial_Board_Reference: MB1331; Internal_Part_Number: MCD-00614; Value: 22uF; Status: Footprint available; Part_Type: Capacitor; Package: C1210; ComponentLink1Description: Murata_22uF_1210_GCM32ER71C226ME19.pdf; ComponentLink1URL: http://tunmcdsvn.tun.st.com/Component_Datasheet_Library/Trunk/Capacitors/Murata_Capacitor_GC_series
C19 = MCD-00594: Capacitor, Tantalum, 1uF, 35V, +/-10%, 595D case A; Manufacturer_Part_Number: 595D105X9035A2T; Manufacturer: VISHAY; Order_Code_RS: 117-404; Provided_By: Subcon; Initial_Board_Reference: MB1331; Revision: July-2002: Re-released for DXP Platform.; Internal_Part_Number: MCD-00594; Status: Footprint available; Part_Type: Capacitor; ComponentLink1Description: VISHAY_CAPACITOR_TANTALUM_595D.pdf; ComponentLink1URL: http://tunmcdsvn.tun.st.com/Component_Datasheet_Library/Trunk/Capacitors/VISHAY_CAPACITOR_TANTALUM_595D; Order_Code_Digikey: 595D105X9035A2T-ND; Order_Code_Farnell: 1166819
C21 C28 = MCD-00102: Capacitor, MLCC, 100nF, 16V, X7R, 10%, 0402, T=0,5mm; Manufacturer_Part_Number: CC0402KRX7R7BB104; Manufacturer: YAGEO; Provided_By: Subcon; Initial_Board_Reference: MB1262; Internal_Part_Number: MCD-00102; Status: Released; Part_Type: Capacitor; Package: C0402; ComponentLink1Description: Yageo_Capacitor_X7R-series.pdf; ComponentLink1URL: http://tunmcdsvn.tun.st.com/Component_Datasheet_Library/Trunk/Capacitors/Yageo_Multilayer_Capacitor_X7R_series_100pF_to_22uF; ECCN_US: n/a; ECCN_EU: n/a
C23 C24 = Cap: Capacitor; Value: 10nF; Published: 8-Jun-2000; Revision: July-2002: Re-released for DXP Platform.; Publisher: Altium Limited
C25 = Cap: Capacitor; Value: 10nF; Fitted: NO; Published: 8-Jun-2000; Revision: July-2002: Re-released for DXP Platform.; Publisher: Altium Limited
C26 C33 = MCD-00595: Capacitor, Tantalum, 4.7uF, 16V, +/-10%, 595D case A; Manufacturer_Part_Number: 595D475X9016A2T; Manufacturer: VISHAY; Order_Code_RS: 117-303; Provided_By: Subcon; Initial_Board_Reference: MB1331; Revision: July-2002: Re-released for DXP Platform.; Internal_Part_Number: MCD-00595; Status: Footprint available; Part_Type: Capacitor; ComponentLink1Description: VISHAY_CAPACITOR_TANTALUM_595D.pdf; ComponentLink1URL: http://tunmcdsvn.tun.st.com/Component_Datasheet_Library/Trunk/Capacitors/VISHAY_CAPACITOR_TANTALUM_595D; Order_Code_Digikey: 595D475X9016A2T-ND; Order_Code_Farnell: 1166805
C27 = Cap Semi: Capacitor (Semiconductor SIM Model); Value: 1uF; Published: 8-Jun-2000; LatestRevisionDate: 29-May-2009; LatestRevisionNote: IPC-7351 Footprint Added.; PackageReference: C1206; Publisher: Altium Limited; PackageDescription: Chip Capacitor
IC1 = STM32H747XIH6: as IC1 on sheet BV100011_ControlSTM32H7; Datasheet Link: https://www.st.com/en/microcontrollers-microprocessors/stm32h747xi.html; Height: 1.1mm; Manufacturer_Part_Number: STM32H747XIH6; Mouser Part Number: 511-STM32H747XIH6; Mouser Price/Stock: https://www.mouser.com/Search/Refine.aspx?Keyword=511-STM32H747XIH6
L1 L3 = Inductor: Value: 100uH; Published: 8-Jun-2000; Revision: July-2002: Re-released for DXP Platform.; Publisher: Altium Limited
L2 = LQM2MPN2R2NG0B: Inductor; Manufacturer_Name: Murata Electronics; Datasheet Link: https://psearch.en.murata.com/inductor/product/LQM2MPN2R2NG0%23.html; Height: 1mm; Manufacturer_Part_Number: LQM2MPN2R2NG0B; Mouser Part Number: N/A; Mouser Price/Stock: https://www.mouser.com/Search/Refine.aspx?Keyword=N%2FA
LD2 = KP-2012SGC: LED; Manufacturer_Name: Kingbright; Datasheet Link: http://my.rs-online.com/webdocs/032f/0900766b8032fa8b.pdf; Height: 1.1mm; Manufacturer_Part_Number: KP-2012SGC; Mouser Part Number: N/A; Mouser Price/Stock: https://www.mouser.com/Search/Refine.aspx?Keyword=N%2FA; RS Part Number: 4663807P; RS Price/Stock: http://uk.rs-online.com/web/p/products/4663807P
R3 R5 R6 = Res3: Resistor; Published: 8-Jun-2000; LatestRevisionDate: 29-May-2009; LatestRevisionNote: IPC-7351 Footprint Added.; PackageReference: J1-0603; Publisher: Altium Limited; PackageDescription: Chip Resistor
  R3: Value: 220
  R5: Value: 0
  R6: Value: 0R
R4 = MCD-00166: Resistor,120K,0402,1%,1/16W; Manufacturer_Part_Number: RC0402FR-07120KL; Manufacturer: YAGEO; Provided_By: Subcon; Initial_Board_Reference: MB1264; Internal_Part_Number: MCD-00166; Value: 120K; Status: Footprint available; Part_Type: Resistor; Package: R0402; ComponentLink1Description: Yageo_Resistor_RC0402-series.pdf; ComponentLink1URL: http://tunmcdsvn.tun.st.com/Component_Datasheet_Library/Trunk/Resistors/Yageo_Resistor_RC0402-series; ECCN_US: n/a; ECCN_EU: n/a
SB2 SB3 = MCD-00071: Solder Bridge ON; Part_Type: Mechanical; Manufacturer_Part_Number: RC0603JR-070RL; Manufacturer: YAGEO; Provided_By: SUBCO; Internal_Part_Number: MCD-00071; Status: Released; ComponentLink1Description: Datasheet; Package: SB0603; ComponentLink1URL: http://tunmcdsvn.tun.st.com/Component_Datasheet_Library/Trunk/Resistors/Yageo_Resistor_RC0603-series; ECCN_US: n/a; ECCN_EU: n/a
SB4 SB5 SB7 SB8 SB12 SB14 SB15 = SB_ON: Fitted: YES; Ordered by: Subcon; Revision: July-2002: Re-released for DXP Platform.; ECCN_US/EU: n/a
SB6 SB9-SB11 SB13 = SB_OFF: Fitted: NO; Ordered by: Subcon; Revision: July-2002: Re-released for DXP Platform.; ECCN_US/EU: n/a
TP1-TP4 = MCD-00630: Test Point 0.3mm; Part_Type: Mechanical; Initial_Board_Reference: MB1264; Internal_Part_Number: MCD-00630; Status: Released; ECCN_US: n/a; ECCN_EU: n/a; Provided_By: n/a
U1 = MCD-01138: IC VREF SERIES 2.5V 8VSSOP; Manufacturer: TI; Provided_By: Subcon; Initial_Board_Reference: MB1381; Internal_Part_Number: MCD-01138; Status: Footprint available; Part_Type: IC; Manufacturer_Part_Number: REF6225IDGKT; Package: VSSOP8; ComponentLink1Description: TI_REF_REF6225IDGKT; ComponentLink1URL: http://tunmcdsvn.tun.st.com/Component_Datasheet_Library/Trunk/IC/TI_REF_REF6225IDGKT/TI_REF_REF6225IDGKT.pdf; ECCN_US: N/A; ECCN_EU: N/A
U2 = MCD-01127: IC REG LDO 3.3V 1.3A 6DFN; Manufacturer: STMICROELECTRONICS; ECCN_US: EAR99; ECCN_EU: NEC; Provided_By: Subcon; Initial_Board_Reference: MB1381; Internal_Part_Number: MCD-01127; Value: ST1L05APU33R; Status: Footprint available; Part_Type: IC; Manufacturer_Part_Number: ST1L05APU33R; Package: DFN6; ComponentLink1Description: STM_LDO_ST1L05CPU33R.pdf; ComponentLink1URL: http://tunmcdsvn.tun.st.com/Component_Datasheet_Library/Trunk/IC/STM_LDO_ST1L05CPU33R/STM_LDO_ST1L05CPU33R.pdf

## Sheet BV100011_ControlMemory.SchDoc
size A4
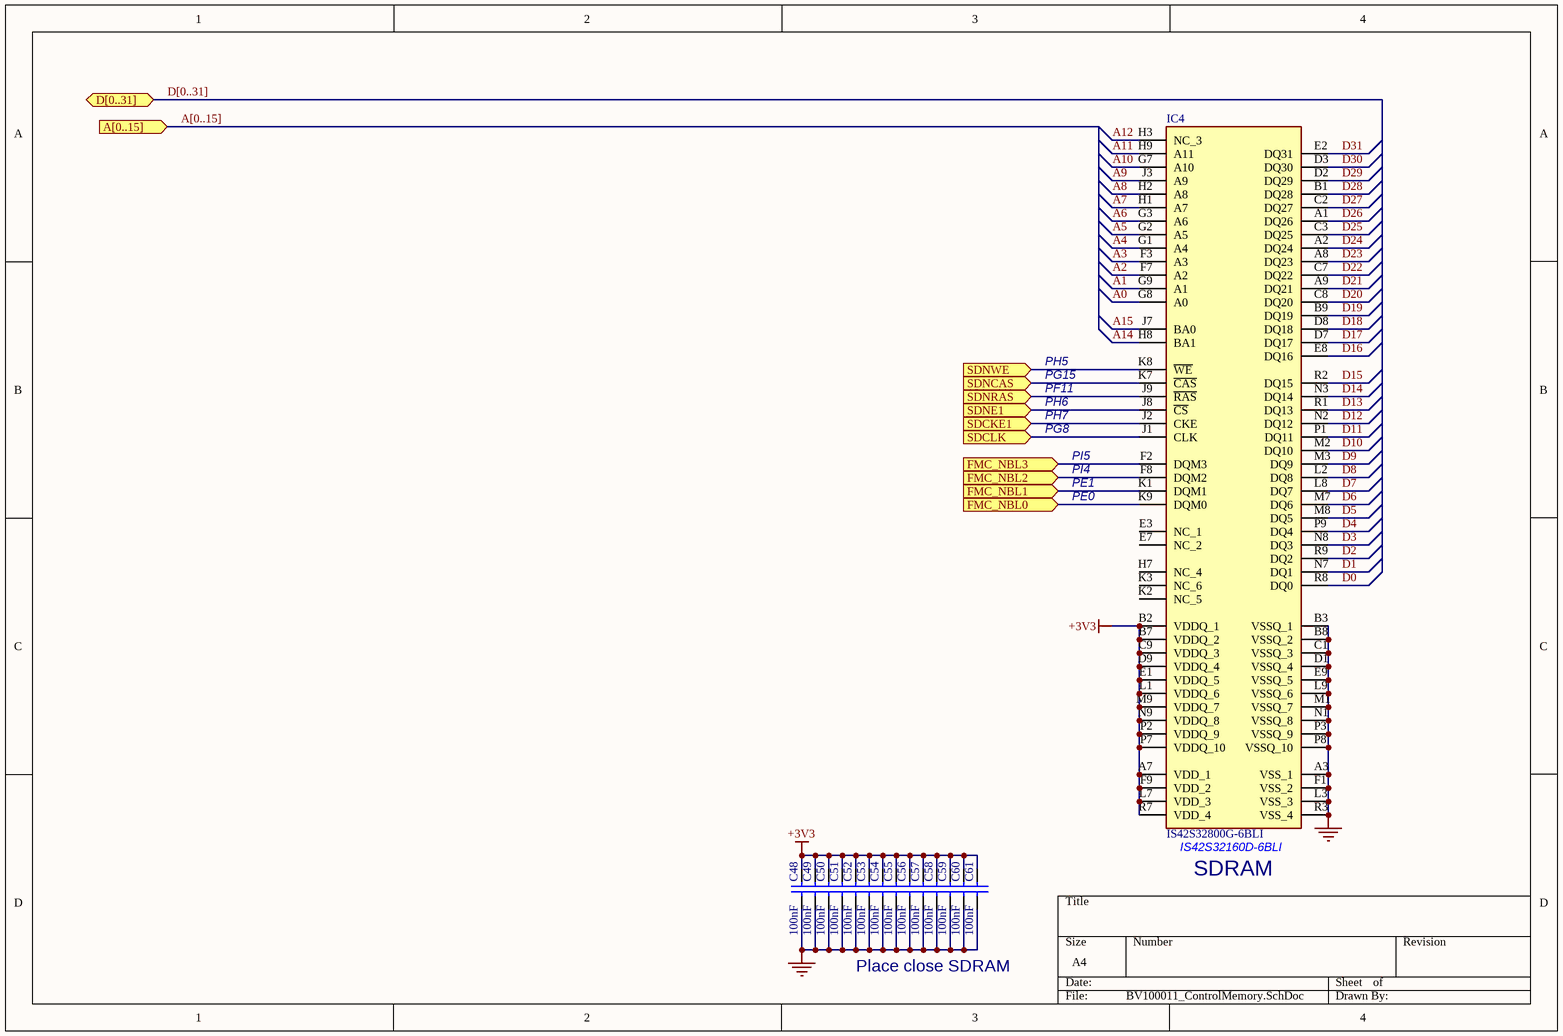
[diagram p3: BV100011_ControlMemory.SchDoc]

### Parts
C48  100nF  [C0603]
C49  100nF  [C0603]
C50  100nF  [C0603]
C51  100nF  [C0603]
C52  100nF  [C0603]
C53  100nF  [C0603]
C54  100nF  [C0603]
C55  100nF  [C0603]
C56  100nF  [C0603]
C57  100nF  [C0603]
C58  100nF  [C0603]
C59  100nF  [C0603]
C60  100nF  [C0603]
C61  100nF  [C0603]
IC4  IS42S32800G-6BLI  [BGA90C80P9X15_800X1300X120]

### Ports
A[0..15] (in), D[0..31] (bidir), FMC_NBL0 (in), FMC_NBL1 (in), FMC_NBL2 (in), FMC_NBL3 (in), SDCKE1 (in), SDCLK (in), SDNCAS (in), SDNE1 (in), SDNRAS (in), SDNWE (in)

### Nets
+3V3: C48.1 C49.1 C50.1 C51.1 C52.1 C53.1 C54.1 C55.1 C56.1 C57.1 C58.1 C59.1 C60.1 C61.1 IC4.A7(VDD_1) IC4.B2(VDDQ_1) IC4.B7(VDDQ_2) IC4.C9(VDDQ_3) IC4.D9(VDDQ_4) IC4.E1(VDDQ_5) IC4.F9(VDD_2) IC4.L1(VDDQ_6) IC4.L7(VDD_3) IC4.M9(VDDQ_7) IC4.N9(VDDQ_8) IC4.P2(VDDQ_9) IC4.P7(VDDQ_10) IC4.R7(VDD_4)
GND: C48.2 C49.2 C50.2 C51.2 C52.2 C53.2 C54.2 C55.2 C56.2 C57.2 C58.2 C59.2 C60.2 C61.2 IC4.A3(VSS_1) IC4.B3(VSSQ_1) IC4.B8(VSSQ_2) IC4.C1(VSSQ_3) IC4.D1(VSSQ_4) IC4.E9(VSSQ_5) IC4.F1(VSS_2) IC4.L3(VSS_3) IC4.L9(VSSQ_6) IC4.M1(VSSQ_7) IC4.N1(VSSQ_8) IC4.P3(VSSQ_9) IC4.P8(VSSQ_10) IC4.R3(VSS_4)
A0: IC4.G8(A0)
A1: IC4.G9(A1)
A2: IC4.F7(A2)
A3: IC4.F3(A3)
A4: IC4.G1(A4)
A5: IC4.G2(A5)
A6: IC4.G3(A6)
A7: IC4.H1(A7)
A8: IC4.H2(A8)
A9: IC4.J3(A9)
A10: IC4.G7(A10)
A11: IC4.H9(A11)
A12: IC4.H3(NC_3)
A14: IC4.H8(BA1)
A15: IC4.J7(BA0)
D0: IC4.R8(DQ0)
D1: IC4.N7(DQ1)
D2: IC4.R9(DQ2)
D3: IC4.N8(DQ3)
D4: IC4.P9(DQ4)
D5: IC4.M8(DQ5)
D6: IC4.M7(DQ6)
D7: IC4.L8(DQ7)
D8: IC4.L2(DQ8)
D9: IC4.M3(DQ9)
D10: IC4.M2(DQ10)
D11: IC4.P1(DQ11)
D12: IC4.N2(DQ12)
D13: IC4.R1(DQ13)
D14: IC4.N3(DQ14)
D15: IC4.R2(DQ15)
D16: IC4.E8(DQ16)
D17: IC4.D7(DQ17)
D18: IC4.D8(DQ18)
D19: IC4.B9(DQ19)
D20: IC4.C8(DQ20)
D21: IC4.A9(DQ21)
D22: IC4.C7(DQ22)
D23: IC4.A8(DQ23)
D24: IC4.A2(DQ24)
D25: IC4.C3(DQ25)
D26: IC4.A1(DQ26)
D27: IC4.C2(DQ27)
D28: IC4.B1(DQ28)
D29: IC4.D2(DQ29)
D30: IC4.D3(DQ30)
D31: IC4.E2(DQ31)
PE0: IC4.K9(DQM0) ; port FMC_NBL0
PE1: IC4.K1(DQM1) ; port FMC_NBL1
PF11: IC4.J9(~{RAS}) ; port SDNRAS
PG8: IC4.J1(CLK) ; port SDCLK
PG15: IC4.K7(~{CAS}) ; port SDNCAS
PH5: IC4.K8(~{WE}) ; port SDNWE
PH6: IC4.J8(~{CS}) ; port SDNE1
PH7: IC4.J2(CKE) ; port SDCKE1
PI4: IC4.F8(DQM2) ; port FMC_NBL2
PI5: IC4.F2(DQM3) ; port FMC_NBL3

Not connected (* = marked no-connect by the designer): IC4 E3(NC_1) E7(NC_2) H7(NC_4) K2(NC_5) K3(NC_6)

### Buses and harness runs
bus A[0..15] = port A[0..15]
bus D[0..31] = port D[0..31]

### Notes on the sheet
- PH5
- PG15
- PF11
- PH6
- PH7
- PG8
- PE1
- PE0
- PI5
- PI4
- (near IC4) IS42S32160D-6BLI
- (near IC4) SDRAM
- Place close SDRAM

### Library data of the parts
C48-C61 = Cap: Capacitor; Value: 10nF; Published: 8-Jun-2000; Revision: July-2002: Re-released for DXP Platform.; Publisher: Altium Limited
IC4 = IS42S32800G-6BLI: Integrated Circuit; Manufacturer_Name: Integrated Silicon Solution Inc.; Datasheet Link: https://www.mouser.com/datasheet/2/198/42-45S32800G-258457.pdf; Height: 1.2mm; Manufacturer_Part_Number: IS42S32800G-6BLI; Mouser Part Number: 870-IS42S32800G-6BLI; Mouser Price/Stock: https://www.mouser.com/Search/Refine.aspx?Keyword=870-IS42S32800G-6BLI

## Nets that join several sheets
+3V3: BV100011_ControlTopLevel (R84.1 R85.1), BV100011_ControlSTM32H7 (5 pins), BV100011_ControlPower (5 pins), BV100011_ControlMemory (28 pins)
GND: BV100011_ControlSTM32H7 (10 pins), BV100011_ControlPower (90 pins), BV100011_ControlMemory (28 pins)
A0: BV100011_ControlSTM32H7 (R60.1), BV100011_ControlMemory (IC4.G8)
A1: BV100011_ControlSTM32H7 (R61.1), BV100011_ControlMemory (IC4.G9)
A2: BV100011_ControlSTM32H7 (R62.1), BV100011_ControlMemory (IC4.F7)
A3: BV100011_ControlSTM32H7 (R63.1), BV100011_ControlMemory (IC4.F3)
A4: BV100011_ControlSTM32H7 (R64.1), BV100011_ControlMemory (IC4.G1)
A5: BV100011_ControlSTM32H7 (R66.1), BV100011_ControlMemory (IC4.G2)
A6: BV100011_ControlSTM32H7 (R73.1), BV100011_ControlMemory (IC4.G3)
A7: BV100011_ControlSTM32H7 (R74.1), BV100011_ControlMemory (IC4.H1)
A8: BV100011_ControlSTM32H7 (R75.1), BV100011_ControlMemory (IC4.H2)
A9: BV100011_ControlSTM32H7 (R76.1), BV100011_ControlMemory (IC4.J3)
A10: BV100011_ControlSTM32H7 (R9.2), BV100011_ControlMemory (IC4.G7)
A11: BV100011_ControlSTM32H7 (R11.2), BV100011_ControlMemory (IC4.H9)
A12: BV100011_ControlSTM32H7 (R13.2), BV100011_ControlMemory (IC4.H3)
A14: BV100011_ControlSTM32H7 (R16.2), BV100011_ControlMemory (IC4.H8)
A15: BV100011_ControlSTM32H7 (R18.2), BV100011_ControlMemory (IC4.J7)
D0: BV100011_ControlSTM32H7 (R31.1), BV100011_ControlMemory (IC4.R8)
D1: BV100011_ControlSTM32H7 (R32.1), BV100011_ControlMemory (IC4.N7)
D2: BV100011_ControlSTM32H7 (R7.1), BV100011_ControlMemory (IC4.R9)
D3: BV100011_ControlSTM32H7 (R8.1), BV100011_ControlMemory (IC4.N8)
D4: BV100011_ControlSTM32H7 (R41.1), BV100011_ControlMemory (IC4.P9)
D5: BV100011_ControlSTM32H7 (R43.1), BV100011_ControlMemory (IC4.M8)
D6: BV100011_ControlSTM32H7 (R45.1), BV100011_ControlMemory (IC4.M7)
D7: BV100011_ControlSTM32H7 (R47.1), BV100011_ControlMemory (IC4.L8)
D8: BV100011_ControlSTM32H7 (R49.1), BV100011_ControlMemory (IC4.L2)
D9: BV100011_ControlSTM32H7 (R51.1), BV100011_ControlMemory (IC4.M3)
D10: BV100011_ControlSTM32H7 (R53.1), BV100011_ControlMemory (IC4.M2)
D11: BV100011_ControlSTM32H7 (R55.1), BV100011_ControlMemory (IC4.P1)
D12: BV100011_ControlSTM32H7 (R57.1), BV100011_ControlMemory (IC4.N2)
D13: BV100011_ControlSTM32H7 (R22.1), BV100011_ControlMemory (IC4.R1)
D14: BV100011_ControlSTM32H7 (R24.1), BV100011_ControlMemory (IC4.N3)
D15: BV100011_ControlSTM32H7 (R26.1), BV100011_ControlMemory (IC4.R2)
D16: BV100011_ControlSTM32H7 (R46.2), BV100011_ControlMemory (IC4.E8)
D17: BV100011_ControlSTM32H7 (R48.2), BV100011_ControlMemory (IC4.D7)
D18: BV100011_ControlSTM32H7 (R50.2), BV100011_ControlMemory (IC4.D8)
D19: BV100011_ControlSTM32H7 (R52.2), BV100011_ControlMemory (IC4.B9)
D20: BV100011_ControlSTM32H7 (R54.2), BV100011_ControlMemory (IC4.C8)
D21: BV100011_ControlSTM32H7 (R56.2), BV100011_ControlMemory (IC4.A9)
D22: BV100011_ControlSTM32H7 (R58.2), BV100011_ControlMemory (IC4.C7)
D23: BV100011_ControlSTM32H7 (R59.2), BV100011_ControlMemory (IC4.A8)
D24: BV100011_ControlSTM32H7 (R10.1), BV100011_ControlMemory (IC4.A2)
D25: BV100011_ControlSTM32H7 (R12.1), BV100011_ControlMemory (IC4.C3)
D26: BV100011_ControlSTM32H7 (R14.1), BV100011_ControlMemory (IC4.A1)
D27: BV100011_ControlSTM32H7 (R15.1), BV100011_ControlMemory (IC4.C2)
D28: BV100011_ControlSTM32H7 (R21.1), BV100011_ControlMemory (IC4.B1)
D29: BV100011_ControlSTM32H7 (R23.1), BV100011_ControlMemory (IC4.D2)
D30: BV100011_ControlSTM32H7 (R28.1), BV100011_ControlMemory (IC4.D3)
D31: BV100011_ControlSTM32H7 (R30.1), BV100011_ControlMemory (IC4.E2)
PD12: BV100011_ControlTopLevel (R85.2), BV100011_ControlSTM32H7 (IC1.R16)
PD13: BV100011_ControlTopLevel (R84.2), BV100011_ControlSTM32H7 (IC1.R17)
PE0: BV100011_ControlSTM32H7 (R35.1), BV100011_ControlMemory (IC4.K9)
PE1: BV100011_ControlSTM32H7 (R36.1), BV100011_ControlMemory (IC4.K1)
PF11: BV100011_ControlSTM32H7 (R72.1), BV100011_ControlMemory (IC4.J9)
PG8: BV100011_ControlSTM32H7 (R25.2), BV100011_ControlMemory (IC4.J1)
PG15: BV100011_ControlSTM32H7 (R34.2), BV100011_ControlMemory (IC4.K7)
PH5: BV100011_ControlSTM32H7 (R40.2), BV100011_ControlMemory (IC4.K8)
PH6: BV100011_ControlSTM32H7 (R42.2), BV100011_ControlMemory (IC4.J8)
PH7: BV100011_ControlSTM32H7 (R44.2), BV100011_ControlMemory (IC4.J2)
PI4: BV100011_ControlSTM32H7 (R17.1), BV100011_ControlMemory (IC4.F8)
PI5: BV100011_ControlSTM32H7 (R19.1), BV100011_ControlMemory (IC4.F2)